# EAGLE schematic clonos (EAGLE 6.4)

## Sheet 1 of 6
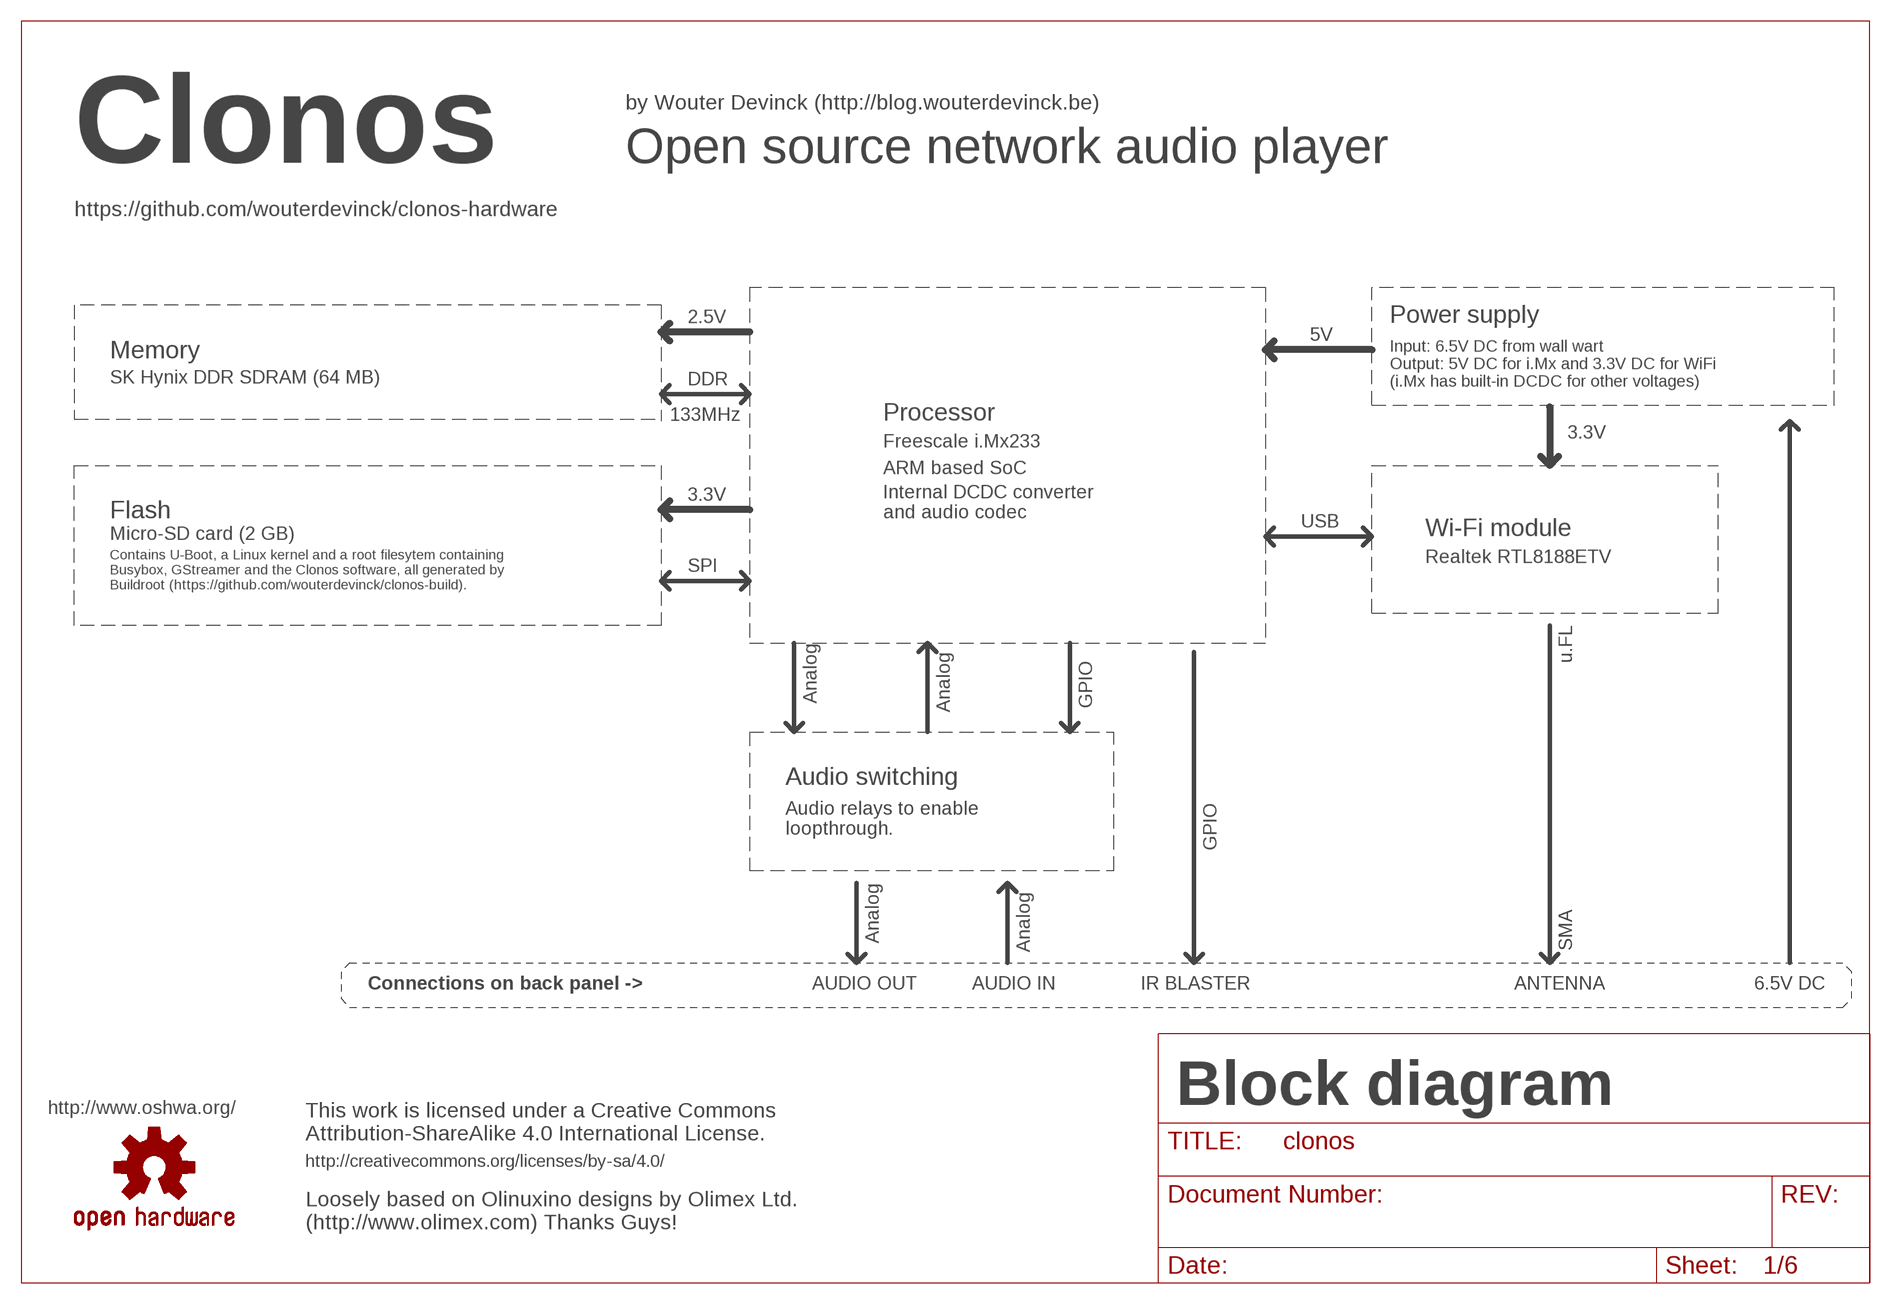
[diagram p0: schematic, sheet 1]

### Parts
LOGO1  OSHW-LOGOS  [OSHW-LOGO-S]

### Notes on the sheet
- by Wouter Devinck (http://blog.wouterdevinck.be)
- Clonos | Open source network audio player
- https://github.com/wouterdevinck/clonos-hardware
- 2.5V | Power supply
- 5V
- Memory
- SK Hynix DDR SDRAM (64 MB) | DDR
- Input: 6.5V DC from wall wart
  Output: 5V DC for i.Mx and 3.3V DC for WiFi
  (i.Mx has built-in DCDC for other voltages)
- 133MHz | Processor
- 3.3V
- Freescale i.Mx233
- ARM based SoC
- 3.3V
- Flash
- Internal DCDC converter 
  and audio codec
- USB
- Micro-SD card (2 GB) | Wi-Fi module
- Realtek RTL8188ETV
- SPI
- Contains U-Boot, a Linux kernel and a root filesytem containing 
  Busybox, GStreamer and the Clonos software, all generated by
  Buildroot (https://github.com/wouterdevinck/clonos-build).
- u.FL
- Analog
- Analog
- GPIO
- Audio switching
- GPIO
- Audio relays to enable
  loopthrough.
- Analog
- Analog
- SMA
- Connections on back panel -> | AUDIO OUT | AUDIO IN | IR BLASTER | ANTENNA | 6.5V DC
- Block diagram
- http://www.oshwa.org/
- This work is licensed under a Creative Commons 
  Attribution-ShareAlike 4.0 International License.
- http://creativecommons.org/licenses/by-sa/4.0/
- Loosely based on Olinuxino designs by Olimex Ltd.
  (http://www.olimex.com) Thanks Guys!

## Sheet 2 of 6
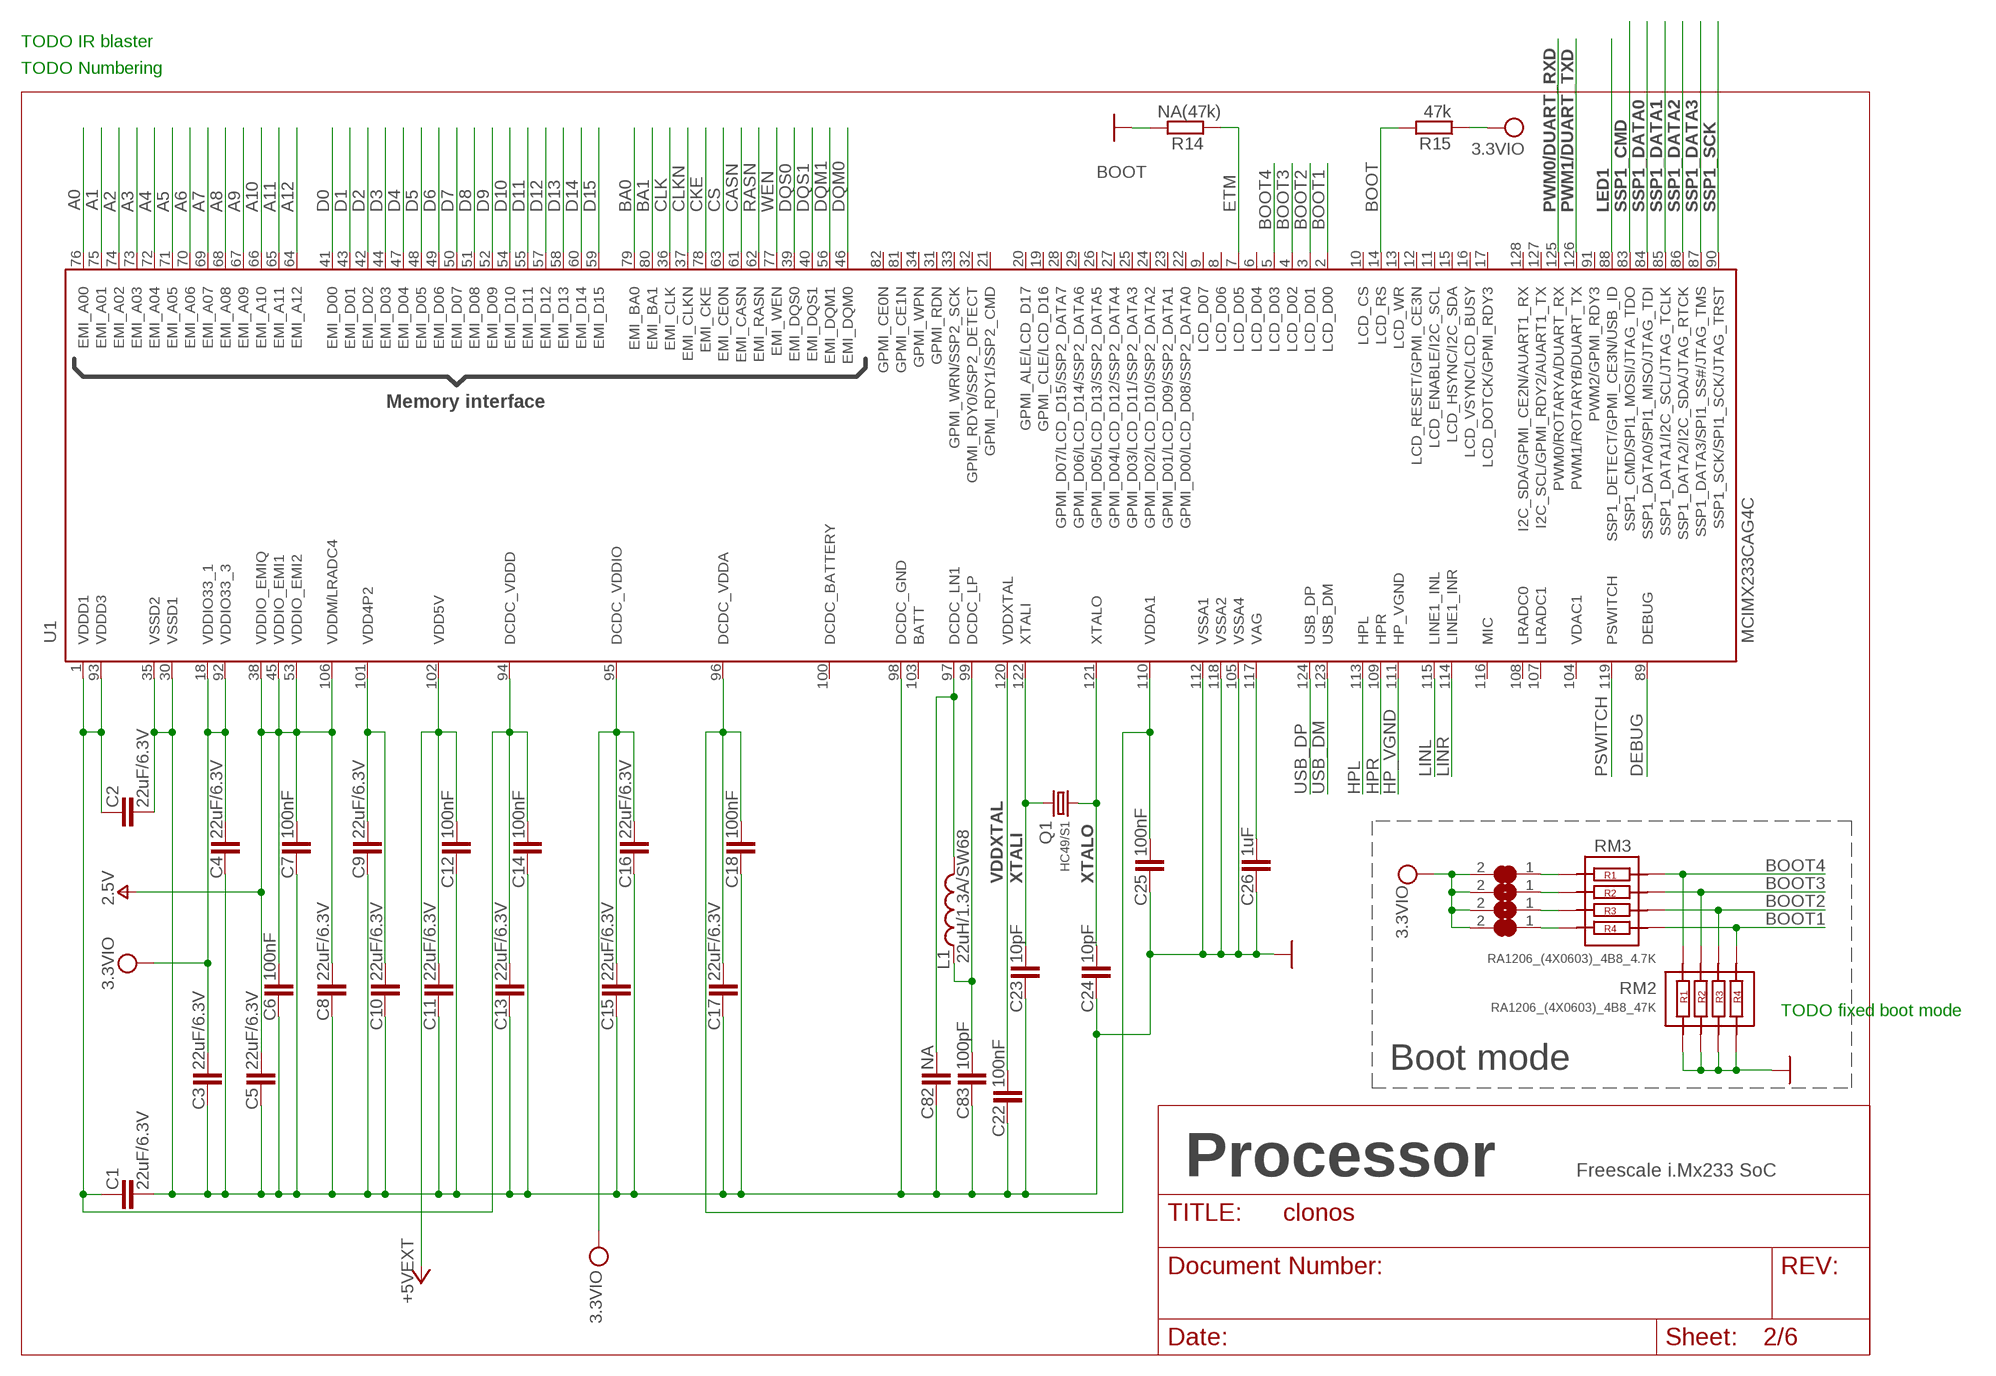
[diagram p1: schematic, sheet 2]

### Parts
C1  22uF/6.3V  C-EUC0805_5MIL_DWS  [C0805_5MIL_DWS]
C2  22uF/6.3V  C-EUC0805_5MIL_DWS  [C0805_5MIL_DWS]
C3  22uF/6.3V  C-EUC0805_5MIL_DWS  [C0805_5MIL_DWS]
C4  22uF/6.3V  C-EUC0805_5MIL_DWS  [C0805_5MIL_DWS]
C5  22uF/6.3V  C-EUC0805_5MIL_DWS  [C0805_5MIL_DWS]
C6  100nF  C-EUC0603_DWS  [C0603_DWS]
C7  100nF  C-EUC0603_DWS  [C0603_DWS]
C8  22uF/6.3V  C-EUC0805_5MIL_DWS  [C0805_5MIL_DWS]
C9  22uF/6.3V  C-EUC0805_5MIL_DWS  [C0805_5MIL_DWS]
C10  22uF/6.3V  C-EUC0805_5MIL_DWS  [C0805_5MIL_DWS]
C11  22uF/6.3V  C-EUC0805_5MIL_DWS  [C0805_5MIL_DWS]
C12  100nF  C-EUC0603_DWS  [C0603_DWS]
C13  22uF/6.3V  C-EUC0805_5MIL_DWS  [C0805_5MIL_DWS]
C14  100nF  C-EUC0603_DWS  [C0603_DWS]
C15  22uF/6.3V  C-EUC0805_5MIL_DWS  [C0805_5MIL_DWS]
C16  22uF/6.3V  C-EUC0805_5MIL_DWS  [C0805_5MIL_DWS]
C17  22uF/6.3V  C-EUC0805_5MIL_DWS  [C0805_5MIL_DWS]
C18  100nF  C-EUC0603_DWS  [C0603_DWS]
C22  100nF  C-EUC0603_DWS  [C0603_DWS]
C23  10pF  C-EUC0603_DWS  [C0603_DWS]
C24  10pF  C-EUC0603_DWS  [C0603_DWS]
C25  100nF  C-EUC0603_DWS  [C0603_DWS]
C26  1uF  C-EUC0603_DWS  [C0603_DWS]
C82  NA  C-EUC0603_DWS  [C0603_DWS]
C83  100pF  C-EUC0603_DWS  [C0603_DWS]
D00_H  Close  SJSJ_SMALLER  [SJ_1_SMALLER]
D01_H  Open  SJSJ_SMALLER  [SJ_1_SMALLER]
D02_H  Open  SJSJ_SMALLER  [SJ_1_SMALLER]
D03_H  Close  SJSJ_SMALLER  [SJ_1_SMALLER]
L1  22uH/1.3A/SW68  L-USL_CD53  [CD53]
Q1  HC49/S1  [HC49/SMD2_THIN]
R14  NA(47k)  R-EU_R0603_5MIL_DWS  [R0603_5MIL_DWS]
R15  47k  R-EU_R0603_5MIL_DWS  [R0603_5MIL_DWS]
RM2  RA1206_(4X0603)_4B8_47K  R_MATRIX_4  [R_MATRIX_4]
RM3  RA1206_(4X0603)_4B8_4.7K  R_MATRIX_4  [R_MATRIX_4]
U1  MCIMX233CAG4C  MCIMX233DAG4B_LD  [TQFP128LD]

### Nets
+5V: C11.2 C12.2 U1.102(VDD5V) ; supply symbol labelled +5VEXT ; also sheet 4,5
A0: U1.76(EMI_A00) ; also sheet 3
A1: U1.75(EMI_A01) ; also sheet 3
A2: U1.74(EMI_A02) ; also sheet 3
A3: U1.73(EMI_A03) ; also sheet 3
A4: U1.72(EMI_A04) ; also sheet 3
A5: U1.71(EMI_A05) ; also sheet 3
A6: U1.70(EMI_A06) ; also sheet 3
A7: U1.69(EMI_A07) ; also sheet 3
A8: U1.68(EMI_A08) ; also sheet 3
A9: U1.67(EMI_A09) ; also sheet 3
A10: U1.66(EMI_A10) ; also sheet 3
A11: U1.65(EMI_A11) ; also sheet 3
A12: U1.64(EMI_A12) ; also sheet 3
BA0: U1.79(EMI_BA0) ; also sheet 3
BA1: U1.80(EMI_BA1) ; also sheet 3
BOOT: R15.2 U1.14(LCD_RS)
BOOT1: RM2.4.2 RM3.4.1 U1.2(LCD_D00)
BOOT2: RM2.3.2 RM3.3.1 U1.3(LCD_D01)
BOOT3: RM2.2.2 RM3.2.1 U1.4(LCD_D02)
BOOT4: RM2.1.2 RM3.1.1 U1.5(LCD_D03)
CASN: U1.61(EMI_CASN) ; also sheet 3
CKE: U1.78(EMI_CKE) ; also sheet 3
CLK: U1.36(EMI_CLK) ; also sheet 3
CLKN: U1.37(EMI_CLKN) ; also sheet 3
CS: U1.63(EMI_CE0N) ; also sheet 3
D0: U1.41(EMI_D00) ; also sheet 3
D1: U1.43(EMI_D01) ; also sheet 3
D2: U1.42(EMI_D02) ; also sheet 3
D3: U1.44(EMI_D03) ; also sheet 3
D4: U1.47(EMI_D04) ; also sheet 3
D5: U1.48(EMI_D05) ; also sheet 3
D6: U1.49(EMI_D06) ; also sheet 3
D7: U1.50(EMI_D07) ; also sheet 3
D8: U1.51(EMI_D08) ; also sheet 3
D9: U1.52(EMI_D09) ; also sheet 3
D10: U1.54(EMI_D10) ; also sheet 3
D11: U1.55(EMI_D11) ; also sheet 3
D12: U1.57(EMI_D12) ; also sheet 3
D13: U1.58(EMI_D13) ; also sheet 3
D14: U1.60(EMI_D14) ; also sheet 3
D15: U1.59(EMI_D15) ; also sheet 3
DCDC_VDDA: C17.2 C18.2 C25.2 U1.96(DCDC_VDDA) U1.110(VDDA1)
DCDC_VDDD: C1.2 C2.2 C13.2 C14.2 U1.1(VDDD1) U1.93(VDDD3) U1.94(DCDC_VDDD)
DEBUG: U1.89(DEBUG) ; also sheet 6
DQM0: U1.46(EMI_DQM0) ; also sheet 3
DQM1: U1.56(EMI_DQM1) ; also sheet 3
DQS0: U1.39(EMI_DQS0) ; also sheet 3
DQS1: U1.40(EMI_DQS1) ; also sheet 3
ETM: R14.2 U1.7(LCD_D05)
GND [PWR]: C1.1 C2.1 C3.1 C4.1 C5.1 C6.1 C7.1 C8.1 C9.1 C10.1 C11.1 C12.1 C13.1 C14.1 C15.1 C16.1 C17.1 C18.1 C22.1 C23.1 C24.1 C25.1 C26.1 C82.1 C83.1 R14.1 RM2.1.1 RM2.2.1 RM2.3.1 RM2.4.1 U1.30(VSSD1) U1.35(VSSD2) U1.98(DCDC_GND) U1.105(VSSA4) U1.112(VSSA1) U1.118(VSSA2) ; also sheet 3,4,5,6
HP_VGND: U1.111(HP_VGND) ; also sheet 4
HPL: U1.113(HPL) ; also sheet 4
HPR: U1.109(HPR) ; also sheet 4
LED1 [PWR]: U1.88(SSP1_DETECT/GPMI_CE3N/USB_ID) ; also sheet 6
LINL: U1.115(LINE1_INL) ; also sheet 4
LINR: U1.114(LINE1_INR) ; also sheet 4
N$18: C82.2 L1.2 U1.97(DCDC_LN1)
N$19: C83.2 L1.1 U1.99(DCDC_LP)
N$25: C26.2 U1.117(VAG)
N$101: D03_H.1 RM3.1.2
N$103: D02_H.1 RM3.2.2
N$104: D01_H.1 RM3.3.2
N$105: D00_H.1 RM3.4.2
PSWITCH: U1.119(PSWITCH) ; also sheet 6
PWM0/DUART_RXD: U1.125(PWM0/ROTARYA/DUART_RX) ; also sheet 6
PWM1/DUART_TXD: U1.126(PWM1/ROTARYB/DUART_TX) ; also sheet 6
RASN: U1.62(EMI_RASN) ; also sheet 3
SSP1_CMD: U1.83(SSP1_CMD/SPI1_MOSI/JTAG_TDO) ; also sheet 6
SSP1_DATA0: U1.84(SSP1_DATA0/SPI1_MISO/JTAG_TDI) ; also sheet 6
SSP1_DATA1: U1.85(SSP1_DATA1/I2C_SCL/JTAG_TCLK) ; also sheet 6
SSP1_DATA2: U1.86(SSP1_DATA2/I2C_SDA/JTAG_RTCK) ; also sheet 6
SSP1_DATA3: U1.87(SSP1_DATA3/SPI1_SS#/JTAG_TMS) ; also sheet 6
SSP1_SCK: U1.90(SSP1_SCK/SPI1_SCK/JTAG_TRST) ; also sheet 6
USB_DM: U1.123(USB_DM) ; also sheet 6
USB_DP: U1.124(USB_DP) ; also sheet 6
V+: C5.2 C6.2 C7.2 C8.2 U1.38(VDDIO_EMIQ) U1.45(VDDIO_EMI1) U1.53(VDDIO_EMI2) U1.106(VDDM/LRADC4) ; supply symbol labelled 2.5V ; also sheet 3
VDD4P2: C9.2 C10.2 U1.101(VDD4P2)
VDDXTAL: C22.2 U1.120(VDDXTAL) ; also sheet 6
VPP [PWR]: C3.2 C4.2 C15.2 C16.2 D00_H.2 D01_H.2 D02_H.2 D03_H.2 R15.1 U1.18(VDDIO33_1) U1.92(VDDIO33_3) U1.95(DCDC_VDDIO) ; supply symbol labelled 3.3VIO ; also sheet 6
WEN: U1.77(EMI_WEN) ; also sheet 3
XTALI: C23.2 Q1.2 U1.122(XTALI) ; also sheet 6
XTALO: C24.2 Q1.1 U1.121(XTALO) ; also sheet 6
Unconnected: U1.6(LCD_D04) U1.8(LCD_D06) U1.9(LCD_D07) U1.10(LCD_CS) U1.11(LCD_ENABLE/I2C_SCL) U1.12(LCD_RESET/GPMI_CE3N) U1.13(LCD_WR) U1.15(LCD_HSYNC/I2C_SDA) U1.16(LCD_VSYNC/LCD_BUSY) U1.17(LCD_DOTCK/GPMI_RDY3) U1.19(GPMI_CLE/LCD_D16) U1.20(GPMI_ALE/LCD_D17) U1.21(GPMI_RDY1/SSP2_CMD) U1.22(GPMI_D00/LCD_D08/SSP2_DATA0) U1.23(GPMI_D01/LCD_D09/SSP2_DATA1) U1.24(GPMI_D02/LCD_D10/SSP2_DATA2) U1.25(GPMI_D03/LCD_D11/SSP2_DATA3) U1.26(GPMI_D05/LCD_D13/SSP2_DATA5) U1.27(GPMI_D04/LCD_D12/SSP2_DATA4) U1.28(GPMI_D07/LCD_D15/SSP2_DATA7) U1.29(GPMI_D06/LCD_D14/SSP2_DATA6) U1.31(GPMI_RDN) U1.32(GPMI_RDY0/SSP2_DETECT) U1.33(GPMI_WRN/SSP2_SCK) U1.34(GPMI_WPN) U1.81(GPMI_CE1N) U1.82(GPMI_CE0N) U1.91(PWM2/GPMI_RDY3) U1.103(BATT) U1.104(VDAC1) U1.107(LRADC1) U1.108(LRADC0) U1.116(MIC) U1.127(I2C_SCL/GPMI_RDY2/AUART1_TX) U1.128(I2C_SDA/GPMI_CE2N/AUART1_RX)

### Notes on the sheet
- TODO IR blaster
- TODO Numbering
- Memory interface
- TODO fixed boot mode
- Boot mode
- Processor | Freescale i.Mx233 SoC

## Sheet 3 of 6
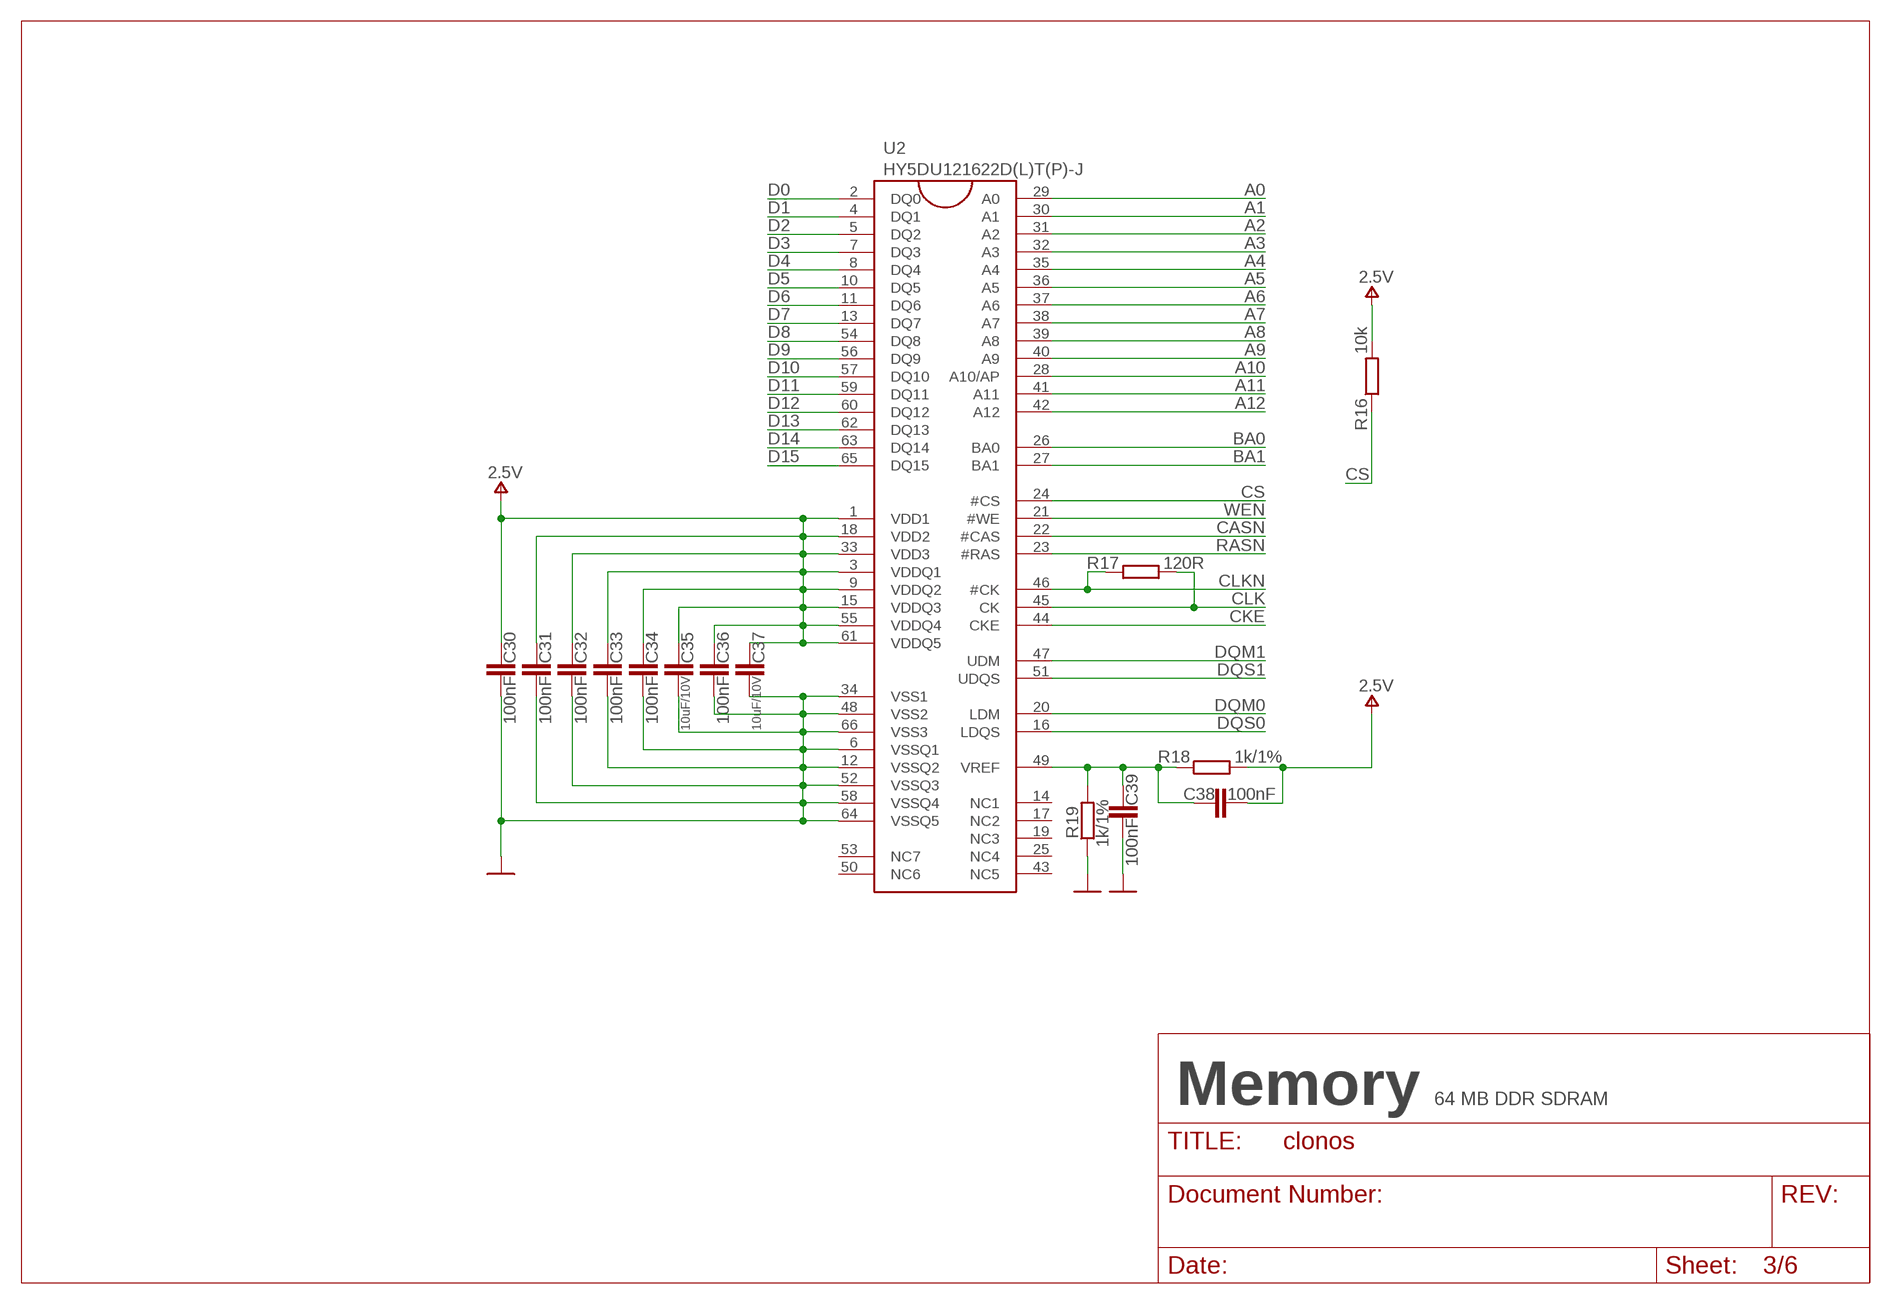
[diagram p2: schematic, sheet 3]

### Parts
C30  100nF  C-EUC0603_DWS  [C0603_DWS]
C31  100nF  C-EUC0603_DWS  [C0603_DWS]
C32  100nF  C-EUC0603_DWS  [C0603_DWS]
C33  100nF  C-EUC0603_DWS  [C0603_DWS]
C34  100nF  C-EUC0603_DWS  [C0603_DWS]
C35  10uF/10V  C-EUC0603_DWS  [C0603_DWS]
C36  100nF  C-EUC0603_DWS  [C0603_DWS]
C37  10uF/10V  C-EUC0603_DWS  [C0603_DWS]
C38  100nF  C-EUC0603_DWS  [C0603_DWS]
C39  100nF  C-EUC0603_DWS  [C0603_DWS]
R16  10k  R-EU_R0603_5MIL_DWS  [R0603_5MIL_DWS]
R17  120R  R-EU_R0603_5MIL_DWS  [R0603_5MIL_DWS]
R18  1k/1%  R-EU_R0603_5MIL_DWS  [R0603_5MIL_DWS]
R19  1k/1%  R-EU_R0603_5MIL_DWS  [R0603_5MIL_DWS]
U2  HY5DU121622D(L)T(P)-J  [66TSOP-II]

### Nets
A0: U2.29(A0) ; also sheet 2
A1: U2.30(A1) ; also sheet 2
A2: U2.31(A2) ; also sheet 2
A3: U2.32(A3) ; also sheet 2
A4: U2.35(A4) ; also sheet 2
A5: U2.36(A5) ; also sheet 2
A6: U2.37(A6) ; also sheet 2
A7: U2.38(A7) ; also sheet 2
A8: U2.39(A8) ; also sheet 2
A9: U2.40(A9) ; also sheet 2
A10: U2.28(A10/AP) ; also sheet 2
A11: U2.41(A11) ; also sheet 2
A12: U2.42(A12) ; also sheet 2
BA0: U2.26(BA0) ; also sheet 2
BA1: U2.27(BA1) ; also sheet 2
CASN: U2.22(#CAS) ; also sheet 2
CKE: U2.44(CKE) ; also sheet 2
CLK: R17.2 U2.45(CK) ; also sheet 2
CLKN: R17.1 U2.46(#CK) ; also sheet 2
CS: R16.1 U2.24(#CS) ; also sheet 2
D0: U2.2(DQ0) ; also sheet 2
D1: U2.4(DQ1) ; also sheet 2
D2: U2.5(DQ2) ; also sheet 2
D3: U2.7(DQ3) ; also sheet 2
D4: U2.8(DQ4) ; also sheet 2
D5: U2.10(DQ5) ; also sheet 2
D6: U2.11(DQ6) ; also sheet 2
D7: U2.13(DQ7) ; also sheet 2
D8: U2.54(DQ8) ; also sheet 2
D9: U2.56(DQ9) ; also sheet 2
D10: U2.57(DQ10) ; also sheet 2
D11: U2.59(DQ11) ; also sheet 2
D12: U2.60(DQ12) ; also sheet 2
D13: U2.62(DQ13) ; also sheet 2
D14: U2.63(DQ14) ; also sheet 2
D15: U2.65(DQ15) ; also sheet 2
DQM0: U2.20(LDM) ; also sheet 2
DQM1: U2.47(UDM) ; also sheet 2
DQS0: U2.16(LDQS) ; also sheet 2
DQS1: U2.51(UDQS) ; also sheet 2
GND [PWR]: C30.1 C31.1 C32.1 C33.1 C34.1 C35.1 C36.1 C37.1 C39.1 R19.1 U2.6(VSSQ1) U2.12(VSSQ2) U2.34(VSS1) U2.48(VSS2) U2.52(VSSQ3) U2.58(VSSQ4) U2.64(VSSQ5) U2.66(VSS3) ; also sheet 2,4,5,6
N$7: C38.2 C39.2 R18.1 R19.2 U2.49(VREF)
RASN: U2.23(#RAS) ; also sheet 2
V+: C30.2 C31.2 C32.2 C33.2 C34.2 C35.2 C36.2 C37.2 C38.1 R16.2 R18.2 U2.1(VDD1) U2.3(VDDQ1) U2.9(VDDQ2) U2.15(VDDQ3) U2.18(VDD2) U2.33(VDD3) U2.55(VDDQ4) U2.61(VDDQ5) ; supply symbol labelled 2.5V ; also sheet 2
WEN: U2.21(#WE) ; also sheet 2
Unconnected: U2.14(NC1) U2.17(NC2) U2.19(NC3) U2.25(NC4) U2.43(NC5) U2.50(NC6) U2.53(NC7)

### Notes on the sheet
- Memory | 64 MB DDR SDRAM

## Sheet 4 of 6
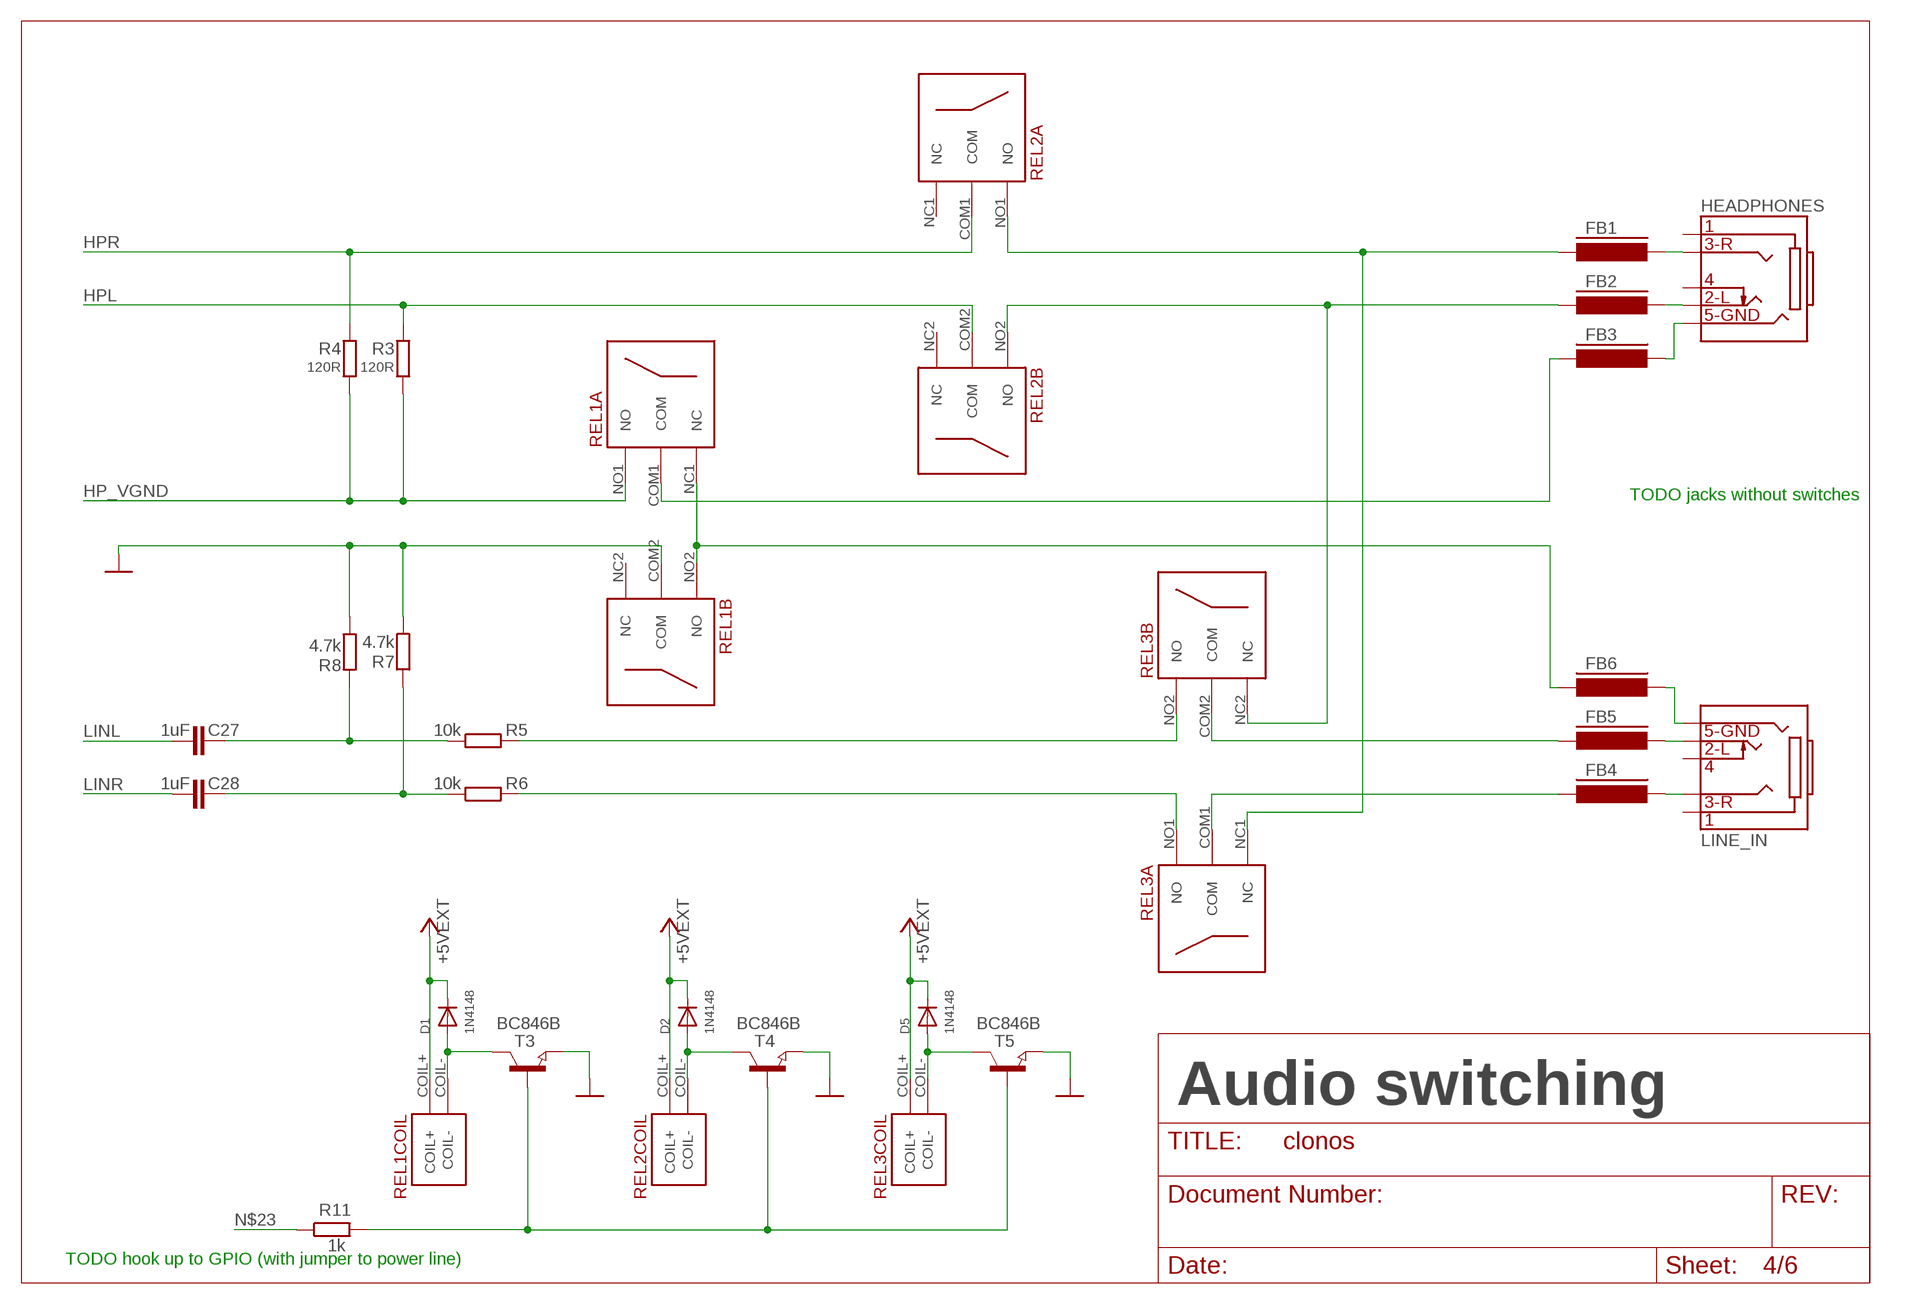
[diagram p3: schematic, sheet 4]

### Parts
C27  1uF  C-EUC0603_DWS  [C0603_DWS]
C28  1uF  C-EUC0603_DWS  [C0603_DWS]
D1  1N4148  DIODESOD-323F  [SOD-323F]
D2  1N4148  DIODESOD-323F  [SOD-323F]
D5  1N4148  DIODESOD-323F  [SOD-323F]
FB1  HZ0805D152R  FERRITE-0805  [FB805]
FB2  HZ0805D152R  FERRITE-0805  [FB805]
FB3  HZ0805D152R  FERRITE-0805  [FB805]
FB4  HZ0805D152R  FERRITE-0805  [FB805]
FB5  HZ0805D152R  FERRITE-0805  [FB805]
FB6  HZ0805D152R  FERRITE-0805  [FB805]
HEADPHONES  AUDIO_JACK_5PINPJ-W47S-05D2-LF_V2  [PJ-W47S-05D2-LF_5PIN_V2]
LINE_IN  AUDIO_JACK_5PINPJ-W47S-05D2-LF_V2  [PJ-W47S-05D2-LF_5PIN_V2]
R3  120R  R-EU_R0603_5MIL_DWS  [R0603_5MIL_DWS]
R4  120R  R-EU_R0603_5MIL_DWS  [R0603_5MIL_DWS]
R5  10k  R-EU_R0603_5MIL_DWS  [R0603_5MIL_DWS]
R6  10k  R-EU_R0603_5MIL_DWS  [R0603_5MIL_DWS]
R7  4.7k  R-EU_R0603_5MIL_DWS  [R0603_5MIL_DWS]
R8  4.7k  R-EU_R0603_5MIL_DWS  [R0603_5MIL_DWS]
R11  1k  R-EU_R0603_5MIL_DWS  [R0603_5MIL_DWS]
REL1  A5W-K-BIS  [A5W-K]
REL2  A5W-K-BIS  [A5W-K]
REL3  A5W-K-BIS  [A5W-K]
T3  BC846B  NPN-TRANSISTOR_SOT23  [SOT23]
T4  BC846B  NPN-TRANSISTOR_SOT23  [SOT23]
T5  BC846B  NPN-TRANSISTOR_SOT23  [SOT23]

### Nets
+5V: D1.C D2.C D5.C REL1.COIL+(COIL:COIL+) REL2.COIL+(COIL:COIL+) REL3.COIL+(COIL:COIL+) ; supply symbol labelled +5VEXT ; also sheet 2,5
GND [PWR]: R7.1 R8.1 REL1.COM2(B:COM) T3.2(E) T4.2(E) T5.2(E) ; also sheet 2,3,5,6
HP_VGND: R3.1 R4.1 REL1.NO1(A:NO) ; also sheet 2
HPL: R3.2 REL2.COM2(B:COM) ; also sheet 2
HPR: R4.2 REL2.COM1(A:COM) ; also sheet 2
LINL: C27.2 ; also sheet 2
LINR: C28.2 ; also sheet 2
N$2: R6.2 REL3.NO1(A:NO)
N$3: FB1.2 REL2.NO1(A:NO) REL3.NC1(A:NC)
N$4: FB2.2 REL2.NO2(B:NO) REL3.NC2(B:NC)
N$5: FB5.2 REL3.COM2(B:COM)
N$6: R5.2 REL3.NO2(B:NO)
N$11: FB4.2 REL3.COM1(A:COM)
N$12: FB3.2 REL1.COM1(A:COM)
N$13: FB1.1 HEADPHONES.3
N$14: FB6.2 REL1.NC1(A:NC) REL1.NO2(B:NO)
N$15: FB2.1 HEADPHONES.2
N$16: FB3.1 HEADPHONES.5
N$17: FB5.1 LINE_IN.2
N$20: FB4.1 LINE_IN.3
N$21: FB6.1 LINE_IN.5
N$22: D1.A REL1.COIL-(COIL:COIL-) T3.3(C)
N$23: R11.1
N$24: D2.A REL2.COIL-(COIL:COIL-) T4.3(C)
N$26: R11.2 T3.1(B) T4.1(B) T5.1(B)
N$29: D5.A REL3.COIL-(COIL:COIL-) T5.3(C)
N$32: C28.1 R6.1 R7.2
N$33: C27.1 R5.1 R8.2
Unconnected: HEADPHONES.1 HEADPHONES.4 LINE_IN.1 LINE_IN.4 REL1.NC2(B:NC) REL2.NC1(A:NC) REL2.NC2(B:NC)

### Notes on the sheet
- TODO jacks without switches
- Audio switching
- TODO hook up to GPIO (with jumper to power line)

## Sheet 5 of 6
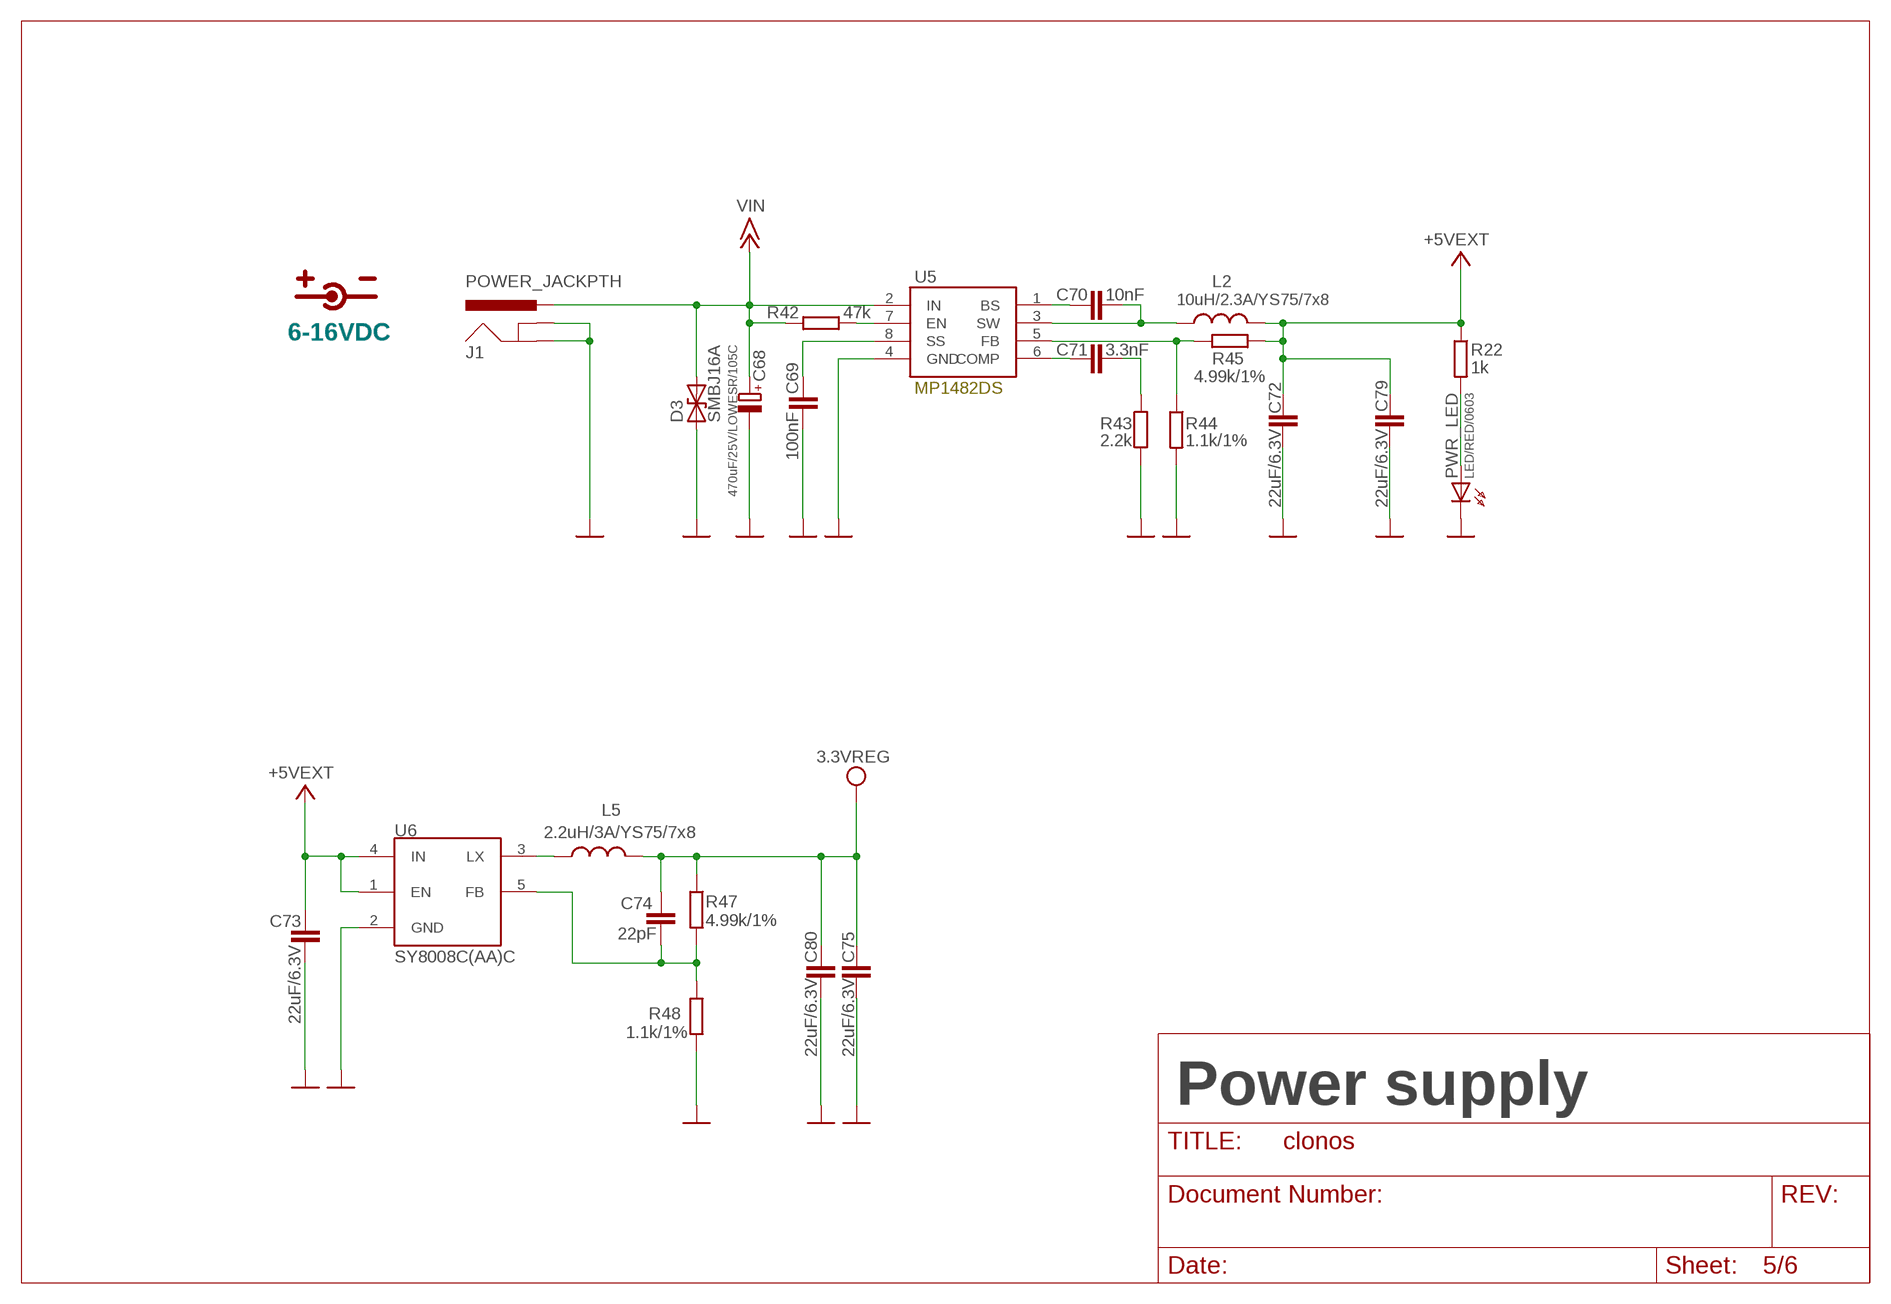
[diagram p4: schematic, sheet 5]

### Parts
C68  470uF/25V/LOWESR/105C  CPOL-EUE5-10.5  [E5-10,5]
C69  100nF  C-EUC0603_DWS  [C0603_DWS]
C70  10nF  C-EUC0603_DWS  [C0603_DWS]
C71  3.3nF  C-EUC0603_DWS  [C0603_DWS]
C72  22uF/6.3V  C-EUC0805_5MIL_DWS  [C0805_5MIL_DWS]
C73  22uF/6.3V  C-EUC0805_5MIL_DWS  [C0805_5MIL_DWS]
C74  22pF  C-EUC0603_DWS  [C0603_DWS]
C75  22uF/6.3V  C-EUC0805_5MIL_DWS  [C0805_5MIL_DWS]
C79  22uF/6.3V  C-EUC0805_5MIL_DWS  [C0805_5MIL_DWS]
C80  22uF/6.3V  C-EUC0805_5MIL_DWS  [C0805_5MIL_DWS]
D3  SMBJ16A  SMBJ15A  [DO214AA]
J1  POWER_JACKPTH  [POWER_JACK_PTH]
L2  10uH/2.3A/YS75/7x8  LLQH88PN100M38  [8X8MM_3131]
L5  2.2uH/3A/YS75/7x8  LLQH88PN100M38  [8X8MM_3131]
PWR_LED  LED/RED/0603  LED0603DWS  [LED-0603]
R22  1k  R-EU_R0603_5MIL_DWS  [R0603_5MIL_DWS]
R42  47k  R-EU_R0603_5MIL_DWS  [R0603_5MIL_DWS]
R43  2.2k  R-EU_R0603_5MIL_DWS  [R0603_5MIL_DWS]
R44  1.1k/1%  R-EU_R0603_5MIL_DWS  [R0603_5MIL_DWS]
R45  4.99k/1%  R-EU_R0603_5MIL_DWS  [R0603_5MIL_DWS]
R47  4.99k/1%  R-EU_R0603_5MIL_DWS  [R0603_5MIL_DWS]
R48  1.1k/1%  R-EU_R0603_5MIL_DWS  [R0603_5MIL_DWS]
U5  MP1482DS  MP1482  [SOIC8]
U6  SY8008C(AA)C  SY8008  [SOT23-5]

### Nets
+5V: C72.1 C73.1 C79.1 L2.2 R22.1 R45.2 U6.1(EN) U6.4(IN) ; supply symbol labelled +5VEXT ; also sheet 2,4
+15V: C68.+ D3.C J1.PWR R42.1 U5.2(IN) ; supply symbol labelled VIN
GND [PWR]: C68.- C69.2 C72.2 C73.2 C75.2 C79.2 C80.2 D3.A J1.GND J1.GNDBREAK PWR_LED.C R43.2 R44.2 R48.2 U5.4(GND) U6.2(GND) ; also sheet 2,3,4,6
N$36: C69.1 U5.8(SS)
N$37: R42.2 U5.7(EN)
N$46: C70.1 U5.1(BS)
N$50: C70.2 L2.1 U5.3(SW)
N$60: C71.1 U5.6(COMP)
N$61: C71.2 R43.1
N$62: R44.1 R45.1 U5.5(FB)
N$64: L5.1 U6.3(LX)
N$66: C74.2 R47.2 R48.1 U6.5(FB)
N$129: PWR_LED.A R22.2
VCC [PWR]: C74.1 C75.1 C80.1 L5.2 R47.1 ; supply symbol labelled 3.3VREG ; also sheet 6

### Notes on the sheet
- 6-16VDC
- Power supply

## Sheet 6 of 6
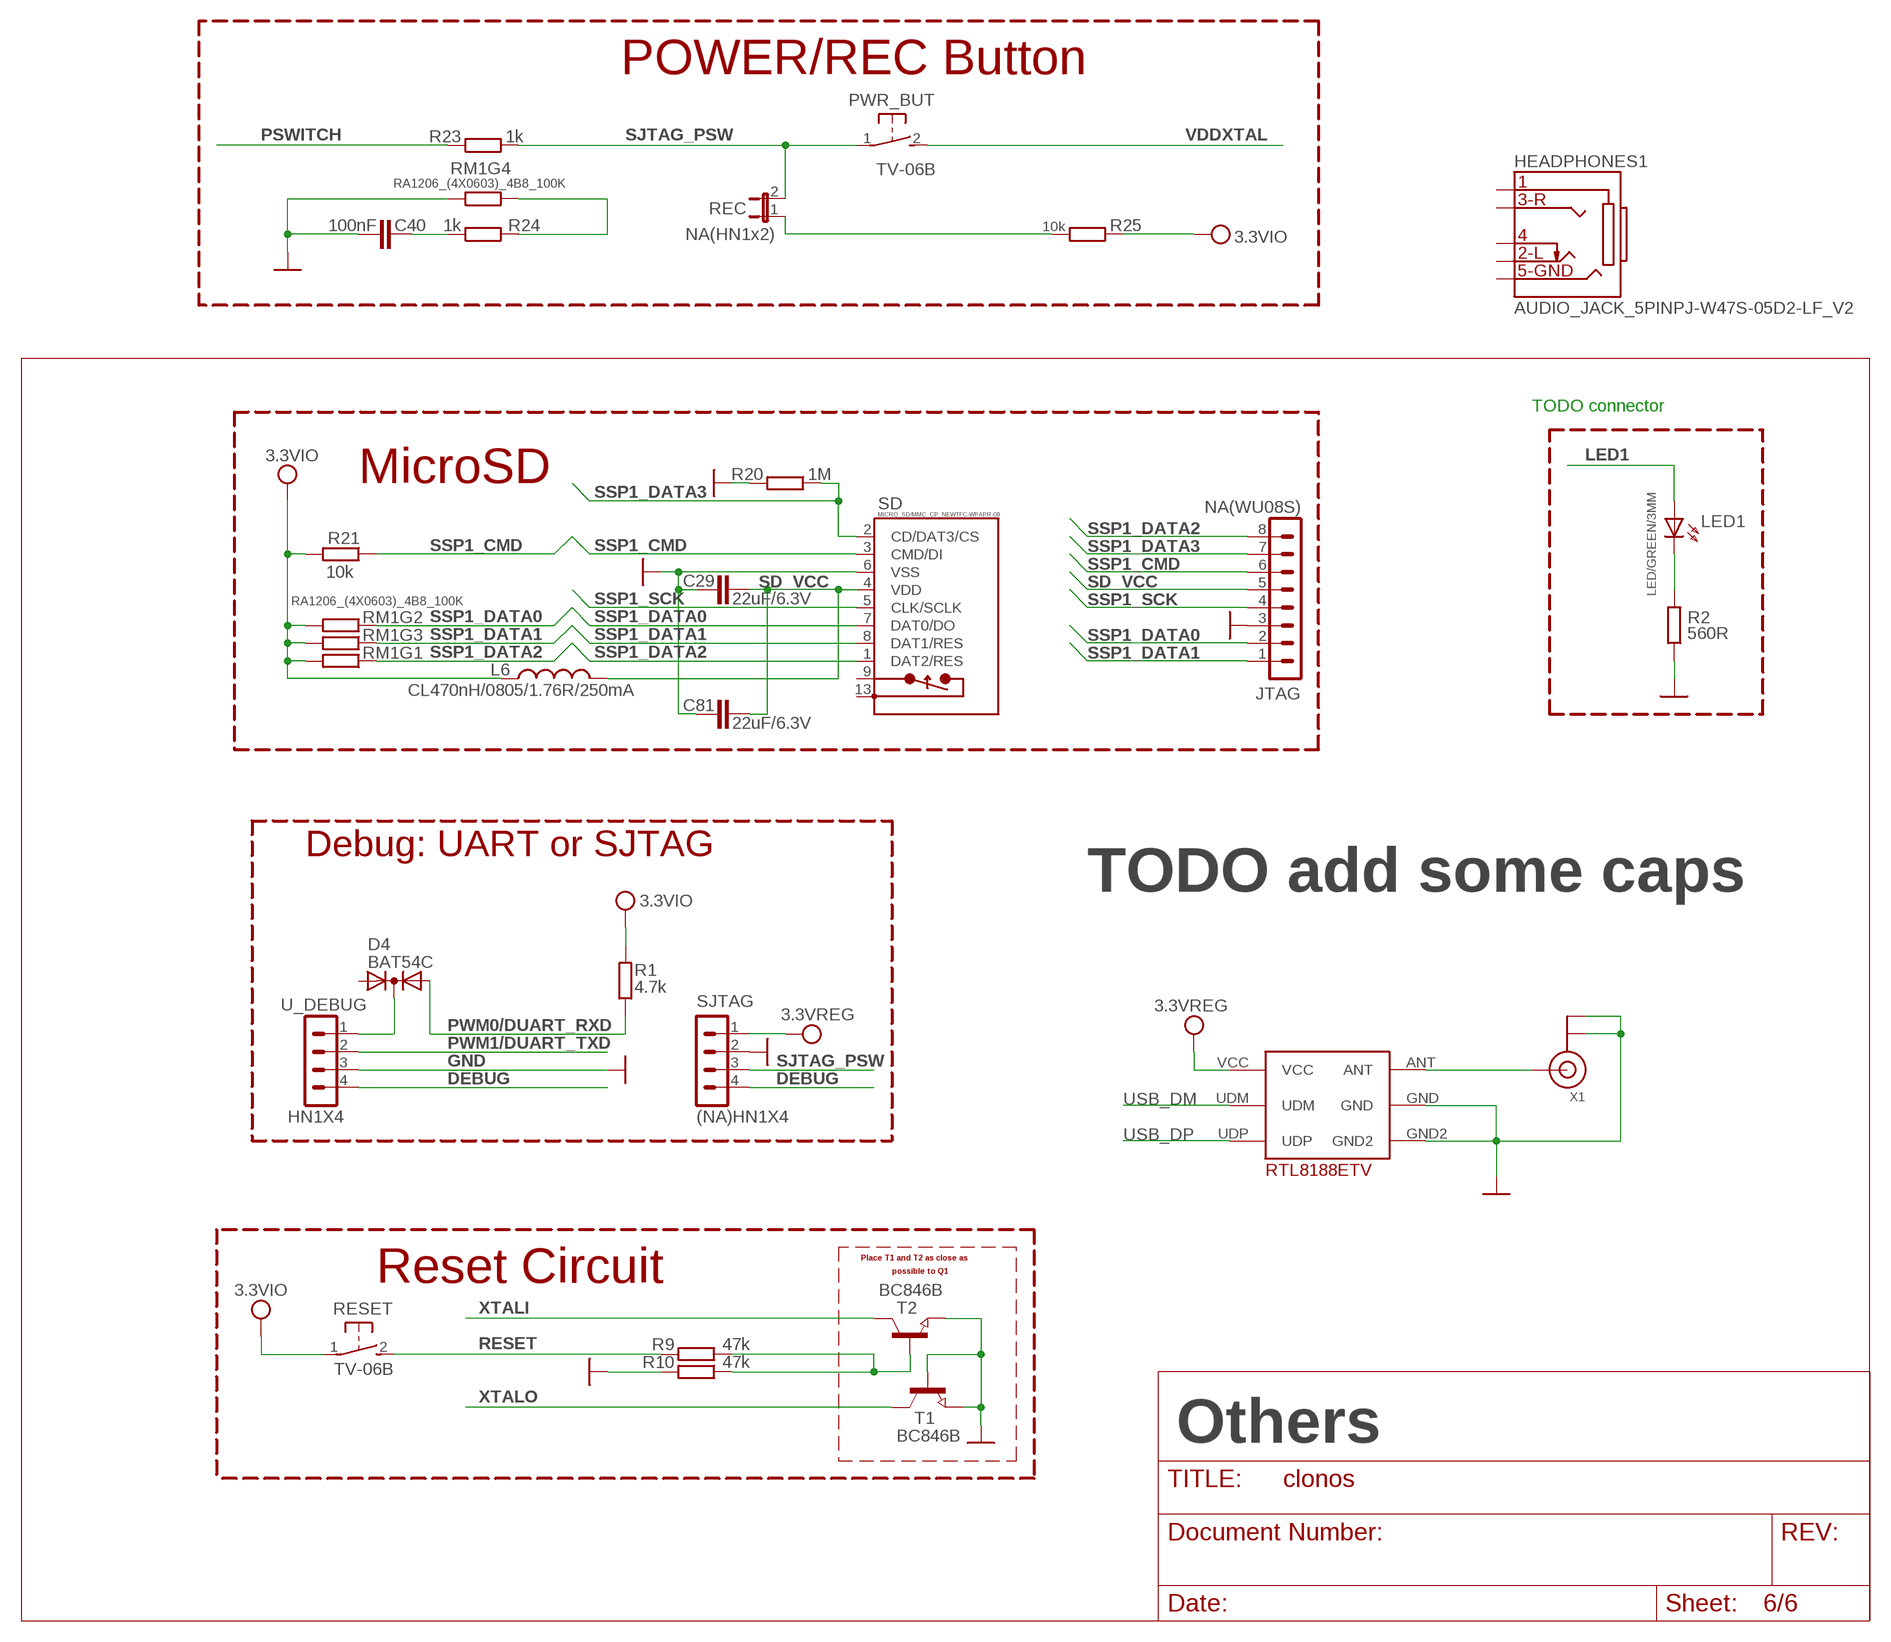
[diagram p5: schematic, sheet 6]

### Parts
C29  22uF/6.3V  C-EUC0805_5MIL_DWS  [C0805_5MIL_DWS]
C40  100nF  C-EUC0603_DWS  [C0603_DWS]
C81  22uF/6.3V  C-EUC0805_5MIL_DWS  [C0805_5MIL_DWS]
D4  BAT54C  DIODE_AC-CA_  [SOT23C]
HEADPHONES1  AUDIO_JACK_5PINPJ-W47S-05D2-LF_V2  [PJ-W47S-05D2-LF_5PIN_V2]
JTAG  NA(WU08S)  CON8WU08S  [WU08S]
L6  CL470nH/0805/1.76R/250mA  L-USL0805_5MIL_DWS  [L0805_5MIL_DWS]
LED1  LED/GREEN/3MM  LED3.0MM  [LED-3.0MM]
PWR_BUT  TV-06B  31-XX  [B3F-31XX]
R1  4.7k  R-EU_R0603_5MIL_DWS  [R0603_5MIL_DWS]
R2  560R  R-EU_R0603_5MIL_DWS  [R0603_5MIL_DWS]
R9  47k  R-EU_R0603_5MIL_DWS  [R0603_5MIL_DWS]
R10  47k  R-EU_R0603_5MIL_DWS  [R0603_5MIL_DWS]
R20  1M  R-EU_R0603_5MIL_DWS  [R0603_5MIL_DWS]
R21  10k  R-EU_R0603_5MIL_DWS  [R0603_5MIL_DWS]
R23  1k  R-EU_R0603_5MIL_DWS  [R0603_5MIL_DWS]
R24  1k  R-EU_R0603_5MIL_DWS  [R0603_5MIL_DWS]
R25  10k  R-EU_R0603_5MIL_DWS_NA  [R0603_5MIL_DWS_NA]
REC  NA(HN1x2)  JP1E  [JP1]
RESET  TV-06B  31-XX  [B3F-31XX]
RM1  RA1206_(4X0603)_4B8_100K  R_MATRIX_4E  [R_MATRIX_4]
SD  MICRO_SD/MMC_CP_NEWTFC-WPAPR-08  [TFC-WPAPR-08]
SJTAG  (NA)HN1X4  CON4HN1X4  [HN1X4]
T1  BC846B  NPN-TRANSISTOR_SOT23  [SOT23]
T2  BC846B  NPN-TRANSISTOR_SOT23  [SOT23]
U$1  RTL8188ETV  [RTL8188ETV]
U_DEBUG  HN1X4  CON4HN1X4  [HN1X4]
X1  ANTENNA_U.FL  [U.FL]

### Nets
DEBUG: SJTAG.4 U_DEBUG.4 ; also sheet 2
GND [PWR]: C29.1 C40.2 C81.1 JTAG.3 R2.1 R10.2 R20.2 RM1.4.1 SD.6(VSS) SJTAG.2 T1.1(B) T1.2(E) T2.2(E) U$1.GND U$1.GND2 U_DEBUG.3 X1.1(GND) X1.2(GND) ; also sheet 2,3,4,5
LED1 [PWR]: LED1.A ; also sheet 2
N$1: U$1.ANT X1.3(SIGNAL)
N$8: R25.1 REC.1
N$9: R24.2 RM1.4.2
N$10: D4.3(K) U_DEBUG.1
N$38: C40.1 R24.1
N$42: LED1.K(C) R2.2
N$43: R9.1 R10.1 T2.1(B)
PSWITCH: R23.1 ; also sheet 2
PWM0/DUART_RXD: D4.1(A1) R1.1 ; also sheet 2
PWM1/DUART_TXD: U_DEBUG.2 ; also sheet 2
RESET: R9.2 RESET.2(S)
SD_VCC: C29.2 C81.2 JTAG.5 L6.2 SD.4(VDD)
SJTAG_PSW: PWR_BUT.1(P) R23.2 REC.2 SJTAG.3
SSP1_CMD: JTAG.6 R21.1 SD.3(CMD/DI) ; also sheet 2
SSP1_DATA0: JTAG.2 RM1.2.1 SD.7(DAT0/DO) ; also sheet 2
SSP1_DATA1: JTAG.1 RM1.3.1 SD.8(DAT1/RES) ; also sheet 2
SSP1_DATA2: JTAG.8 RM1.1.1 SD.1(DAT2/RES) ; also sheet 2
SSP1_DATA3: JTAG.7 R20.1 SD.2(CD/DAT3/CS) ; also sheet 2
SSP1_SCK: JTAG.4 SD.5(CLK/SCLK) ; also sheet 2
USB_DM: U$1.UDM ; also sheet 2
USB_DP: U$1.UDP ; also sheet 2
VCC [PWR]: SJTAG.1 U$1.VCC ; supply symbol labelled 3.3VREG ; also sheet 5
VDDXTAL: PWR_BUT.2(S) ; also sheet 2
VPP [PWR]: L6.1 R1.2 R21.2 R25.2 RESET.1(P) RM1.1.2 RM1.2.2 RM1.3.2 ; supply symbol labelled 3.3VIO ; also sheet 2
XTALI: T2.3(C) ; also sheet 2
XTALO: T1.3(C) ; also sheet 2
Unconnected: D4.2(A2) HEADPHONES1.1 HEADPHONES1.2 HEADPHONES1.3 HEADPHONES1.4 HEADPHONES1.5 SD.9(CP_E) SD.10(PACK1) SD.11(PACK2) SD.12(PACK3) SD.13(PACK4)

### Notes on the sheet
- POWER/REC Button
- TODO connector
- MicroSD
- Debug: UART or SJTAG
- TODO add some caps
- Place T1 and T2 as close as
- possible to Q1
- Reset Circuit
- Others

## Power pins joined to a net without a drawn wire
DCDC_BATTERY: U1.100(DCDC_BATTERY)

## Library data of the parts
C1-C18 C22-C40 C69-C75 C79-C83 = rcl:C-EU: CAPACITOR, European symbol
C68 = rcl:CPOL-EU: POLARIZED CAPACITOR, European symbol
D00_H D01_H D02_H D03_H = jumper:SJ: SMD solder JUMPER
D1 D2 D5 = adafruit:DIODE: Diode SMADIODE - SMA Surface Mount Package 20V 1A Schottky Diode Digikey: 641-1014-6-ND DO-1N4148 - Through Hole Small Current Diode SOD-123 20V 1 A (.5mV Vf) Schottky Diode - Digikey: MBRX120TPMSCT-ND SOD-323 10V 570mA (.38mV Vf, 3ns) Schottky Diode - Digikey: ZLLS410CT-ND SOD-523 30V 30mA Schottky Diode (RB751S-40TE61) - Digikey: RB751S-40TE61CT-ND SOT23-R/W - SOT23 Package (R = Solder Paste/Reflow Ovens, W = Hand-Soldering) BAT54Film 40V 300mA - Digikey: 497-7162-1-ND
D3 = OLIMEX_DISCRET:SMBJ15A
D4 = semicon-smd-ipc:DIODE_AC-CA_: DUAL DIODE
FB1-FB6 = dp_devices:FERRITE: Ferrite bead in various packages
HEADPHONES HEADPHONES1 LINE_IN = gogo:AUDIO_JACK_5PIN
J1 = SparkFun-Connectors:POWER_JACK: Power Jack This is the standard 5.5mm barrel jack for power. The PTH is the most common, proven, reliable, footprint. The Slot footprint only works if the mill layer is transmitted to the PCB fab house so be warned. Spark Fun Electronics SKU : PRT-00119 SMT: CONN-08106 Mating wall wart : TOL-00298 (and others)
JTAG = Penko:CON8
L1 L6 = rcl:L-US: INDUCTOR, American symbol
L2 L5 = OLIMEX_DISCRET:L
LED1 PWR_LED = DOUBLE-SIDE:LED
LOGO1 = SparkFun-Aesthetics:OSHW-LOGO: Open Source Hardware Logo This logo indicates the piece of hardware it is found on incorporates a OSHW license and/or adheres to the definition of open source hardware found here: http://freedomdefined.org/OSHW
PWR_BUT RESET = switch-omron:31-XX: OMRON SWITCH
Q1 = crystal:HC49/S: CRYSTAL
R1-R11 R14-R25 R42-R45 R47 R48 = rcl:R-EU_: RESISTOR, European symbol
REC = jumper:JP1E: JUMPER
REL1-REL3 = clonos:A5W-K-BIS
RM1 = OLIMEX_DISCRET:R_MATRIX_4E
RM2 RM3 = OLIMEX_DISCRET:R_MATRIX_4
SD = OLIMEX_CONNECTORS:MICRO_SD/MMC_CP_NEW
SJTAG U_DEBUG = Penko:CON4
T1-T5 = semicon-smd-ipc:NPN-TRANSISTOR_: NPN TRANSISTOR
U1 = OLIMEX_IC:MCIMX233DAG4B: i.MX23
U2 = OLIMEX_IC:HY5DU121622D(L)T(P)
U5 = OLIMEX_IC:MP1482
U6 = OLIMEX_IC:SY8008
U$1 = clonos:RTL8188ETV
X1 = adafruit:ANTENNA_U.FL: U.FL Antenna Connector

## Net classes
1 PWR: width 0.203 mm, drill 0.4 mm, clearance 0.076 mm